# EAGLE design BinaryWatch_v0_4_OptR_fix (EAGLE 9.5.1)
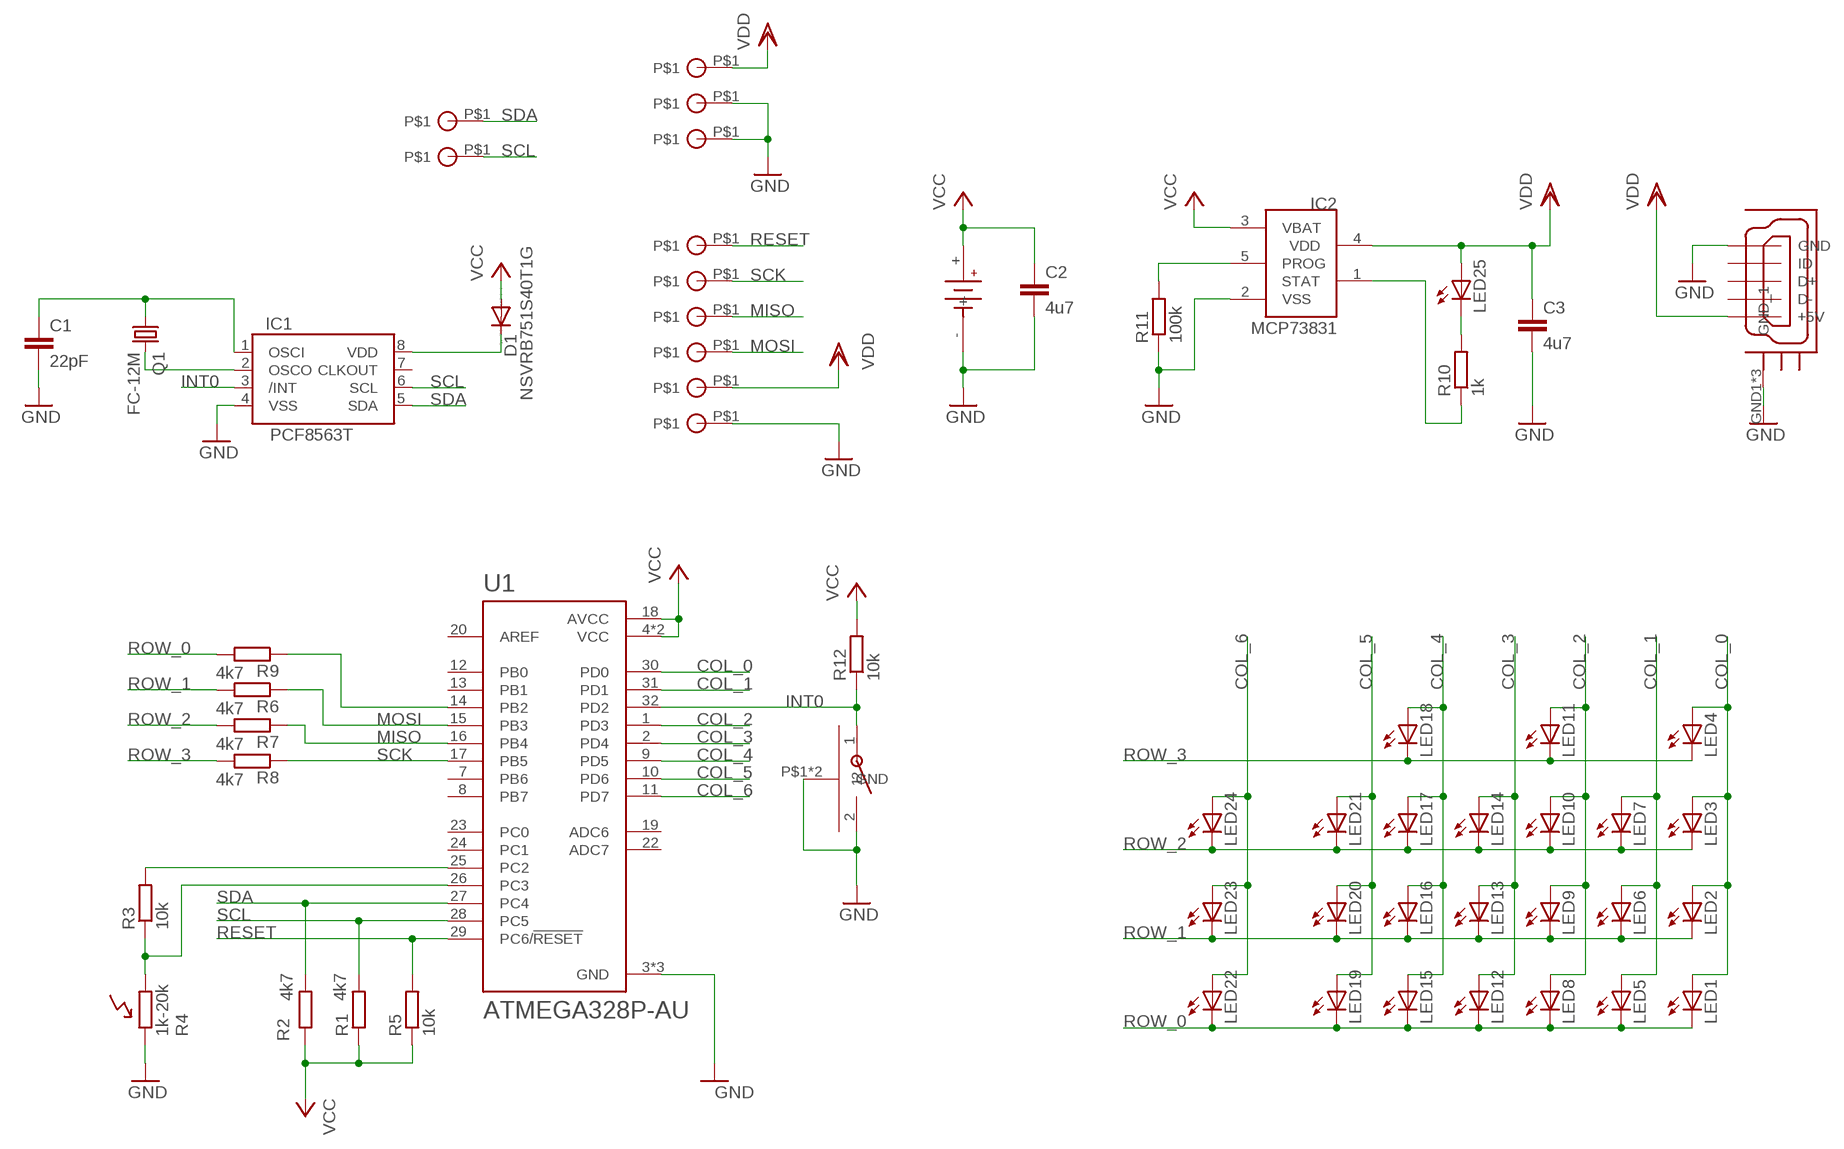
[diagram p0: schematic, sheet 1]

## Parts
C1  22pF  C-EUC0603  [C0603]
C2  4u7  C-EUC0603  [C0603]
C3  4u7  C-EUC0603  [C0603]
D1  NSVRB751S40T1G  DIODE-SOD523  [SOD523]
IC1  PCF8563T  [SO8]
IC2  MCP73831  [SOT23-5L]
LED1  LEDSML0603  [SML0603]
LED2  LEDSML0603  [SML0603]
LED3  LEDSML0603  [SML0603]
LED4  LEDSML0603  [SML0603]
LED5  LEDSML0603  [SML0603]
LED6  LEDSML0603  [SML0603]
LED7  LEDSML0603  [SML0603]
LED8  LEDSML0603  [SML0603]
LED9  LEDSML0603  [SML0603]
LED10  LEDSML0603  [SML0603]
LED11  LEDSML0603  [SML0603]
LED12  LEDSML0603  [SML0603]
LED13  LEDSML0603  [SML0603]
LED14  LEDSML0603  [SML0603]
LED15  LEDSML0603  [SML0603]
LED16  LEDSML0603  [SML0603]
LED17  LEDSML0603  [SML0603]
LED18  LEDSML0603  [SML0603]
LED19  LEDSML0603  [SML0603]
LED20  LEDSML0603  [SML0603]
LED21  LEDSML0603  [SML0603]
LED22  LEDSML0603  [SML0603]
LED23  LEDSML0603  [SML0603]
LED24  LEDSML0603  [SML0603]
LED25  LEDSML0603  [SML0603]
Q1  FC-12M  [FC-12M]
R1  4k7  R-EU_R0603  [R0603]
R2  4k7  R-EU_R0603  [R0603]
R3  10k  R-EU_R0603  [R0603]
R4  1k-20k  OPTO_RES_ROUND_3_5MM  [OPTO_RES_ROUND_3_5MM]
R5  10k  R-EU_R0603  [R0603]
R6  4k7  R-EU_R0603  [R0603]
R7  4k7  R-EU_R0603  [R0603]
R8  4k7  R-EU_R0603  [R0603]
R9  4k7  R-EU_R0603  [R0603]
R10  1k  R-EU_R0603  [R0603]
R11  100k  R-EU_R0603  [R0603]
R12  10k  R-EU_R0603  [R0603]
U1  ATMEGA328P-AU  [QFP80P900X900X120-32N]
U$1  2032  [2032_45DEG]
U$2  CONTACT_1_8MM  [CONTACT_1_8MM]
U$3  CONTACT_1_8MM  [CONTACT_1_8MM]
U$4  CONTACT_1_8MM  [CONTACT_1_8MM]
U$5  CONTACT_1_8MM  [CONTACT_1_8MM]
U$6  CONTACT_1_8MM  [CONTACT_1_8MM]
U$7  CONTACT_1_8MM  [CONTACT_1_8MM]
U$8  TACK_SWITCH  [TL3330]
U$9  CONTACT_1_8MM  [CONTACT_1_8MM]
U$10  MICRO_USB_VERTICAL  [MICRO_USB_VERTICAL]
U$11  CONTACT_1_8MM  [CONTACT_1_8MM]
U$12  CONTACT_1_8MM  [CONTACT_1_8MM]
U$13  CONTACT_1_8MM  [CONTACT_1_8MM]
U$14  CONTACT_1_8MM  [CONTACT_1_8MM]

## Nets
COL_0: LED1.A LED2.A LED3.A LED4.A U1.30(PD0)
COL_1: LED5.A LED6.A LED7.A U1.31(PD1)
COL_2: LED8.A LED9.A LED10.A LED11.A U1.1(PD3)
COL_3: LED12.A LED13.A LED14.A U1.2(PD4)
COL_4: LED15.A LED16.A LED17.A LED18.A U1.9(PD5)
COL_5: LED19.A LED20.A LED21.A U1.10(PD6)
COL_6: LED22.A LED23.A LED24.A U1.11(PD7)
GND: C1.2 C2.2 C3.2 IC1.4(VSS) IC2.2(VSS) R4.P$1 R11.1 U1.3(GND) U1.5(GND) U1.21(GND) U$1.- U$2.P$1 U$8.2 U$8.P$1(GND) U$8.P$2(GND) U$9.P$1 U$10.5(GND) U$10.GND1(GND_1) U$10.GND2(GND_1) U$10.GND3(GND_1) U$12.P$1
INT0: IC1.3(/INT) R12.1 U1.32(PD2) U$8.1
MISO: R7.1 U1.16(PB4) U$5.P$1
MOSI: R6.1 U1.15(PB3) U$4.P$1
N$1: IC1.2(OSCO) Q1.2
N$2: C1.1 IC1.1(OSCI) Q1.1
N$3: R3.1 R4.P$2 U1.26(PC3)
N$4: R3.2 U1.25(PC2)
N$6: R9.1 U1.14(PB2)
N$7: D1.C IC1.8(VDD)
N$12: IC2.1(STAT) R10.1
N$13: LED25.C R10.2
N$15: IC2.5(PROG) R11.2
RESET: R5.2 U1.29(PC6/!RESET) U$7.P$1
ROW_0: LED1.C LED5.C LED8.C LED12.C LED15.C LED19.C LED22.C R9.2
ROW_1: LED2.C LED6.C LED9.C LED13.C LED16.C LED20.C LED23.C R6.2
ROW_2: LED3.C LED7.C LED10.C LED14.C LED17.C LED21.C LED24.C R7.2
ROW_3: LED4.C LED11.C LED18.C R8.2
SCK: R8.1 U1.17(PB5) U$6.P$1
SCL: IC1.6(SCL) R1.2 U1.28(PC5) U$14.P$1
SDA: IC1.5(SDA) R2.2 U1.27(PC4) U$13.P$1
VCC: C2.1 D1.A IC2.3(VBAT) R1.1 R2.1 R5.1 R12.2 U1.4(VCC) U1.6(VCC) U1.18(AVCC) U$1.+
VDD: C3.1 IC2.4(VDD) LED25.A U$3.P$1 U$10.1(+5V) U$11.P$1
Unconnected: IC1.7(CLKOUT) U1.7(PB6) U1.8(PB7) U1.12(PB0) U1.13(PB1) U1.19(ADC6) U1.20(AREF) U1.22(ADC7) U1.23(PC0) U1.24(PC1) U$10.2(D-) U$10.3(D+) U$10.4(ID)

## Library data of the parts
C1-C3 = rcl:C-EU: CAPACITOR, European symbol
D1 = diode:DIODE-: DIODE
IC1 = philips-4:PCF8563
IC2 = microchip-update:MCP73831: Miniature Single-Cell, Fully Integrated Li-Ion, Li-Polymer Charge Management Controllers
LED1-LED25 = led:LED: LED OSRAM: - CHIPLED LG R971, LG N971, LY N971, LG Q971, LY Q971, LO R971, LY R971 LH N974, LH R974 LS Q976, LO Q976, LY Q976 LO Q996 - Hyper CHIPLED LW Q18S LB Q993, LB Q99A, LB R99A - SideLED LS A670, LO A670, LY A670, LG A670, LP A670 LB A673, LV A673, LT A673, LW A673 LH A674 LY A675 LS A676, LA A676, LO A676, LY A676, LW A676 LS A679, LY A679, LG A679 - Hyper Micro SIDELED® LS Y876, LA Y876, LO Y876, LY Y876 LT Y87S - SmartLED LW L88C, LW L88S LB L89C, LB L89S, LG L890 LS L89K, LO L89K, LY L89K LS L896, LA L896, LO L896, LY L896 - TOPLED LS T670, LO T670, LY T670, LG T670, LP T670 LSG T670, LSP T670, LSY T670, LOP T670, LYG T670 LG T671, LOG T671, LSG T671 LB T673, LV T673, LT T673, LW T673 LH T674 LS T676, LA T676, LO T676, LY T676, LB T676, LH T676, LSB T676, LW T676 LB T67C, LV T67C, LT T67C, LS T67K, LO T67K, LY T67K, LW E67C LS E67B, LA E67B, LO E67B, LY E67B, LB E67C, LV E67C, LT E67C LW T67C LS T679, LY T679, LG T679 LS T770, LO T770, LY T770, LG T770, LP T770 LB T773, LV T773, LT T773, LW T773 LH T774 LS E675, LA E675, LY E675, LS T675 LS T776, LA T776, LO T776, LY T776, LB T776 LHGB T686 LT T68C, LB T68C - Hyper Mini TOPLED® LB M676 - Mini TOPLED Santana® LG M470 LS M47K, LO M47K, LY M47K Source: http://www.osram.convergy.de LUXEON: - LUMILED® LXK2-PW12-R00, LXK2-PW12-S00, LXK2-PW14-U00, LXK2-PW14-V00 LXK2-PM12-R00, LXK2-PM12-S00, LXK2-PM14-U00 LXK2-PE12-Q00, LXK2-PE12-R00, LXK2-PE12-S00, LXK2-PE14-T00, LXK2-PE14-U00 LXK2-PB12-K00, LXK2-PB12-L00, LXK2-PB12-M00, LXK2-PB14-N00, LXK2-PB14-P00, LXK2-PB14-Q00 LXK2-PR12-L00, LXK2-PR12-M00, LXK2-PR14-Q00, LXK2-PR14-R00 LXK2-PD12-Q00, LXK2-PD12-R00, LXK2-PD12-S00 LXK2-PH12-R00, LXK2-PH12-S00 LXK2-PL12-P00, LXK2-PL12-Q00, LXK2-PL12-R00 Source: www.luxeon.com KINGBRIGHT: KA-3528ASYC Source: www.kingbright.com
Q1 = crystal:FC-12M: kHz RANGE CRYSTAL UNIT LOW PROFILE SMD Source: Epson Toyocom FC-12M.pdf
R1 R2 R5-R9 = resistor:R-EU_: RESISTOR, European symbol
R3 R10 R11 = rcl:R-EU_: RESISTOR, European symbol
R4 = opto-resistor:OPTO_RES_ROUND_3_5MM
R12 = rcl:R-EU_: RESISTOR, European symbol; SPICEPREFIX: R
U1 = ATMEGA328P-AU:ATMEGA328P-AU: ATmega Series 20 MHz 32 KB Flash 2 KB SRAM 8-Bit Microcontroller - TQFP-32; AVAILABILITY: Unavailable; DESCRIPTION: Microcontroller Mcu, 8 Bit, Atmega, 20mhz, Tqfp-32; MF: Microchip; MP: ATMEGA328P-AU; PACKAGE: TQFP-32 Microchip; PRICE: None
U$1 = 2032 free standing:2032
U$2-U$7 U$9 U$11-U$14 = Pins, switches:CONTACT_1_8MM
U$8 = Pins, switches:TACK_SWITCH
U$10 = Pins, switches:MICRO_USB_VERTICAL

## Board
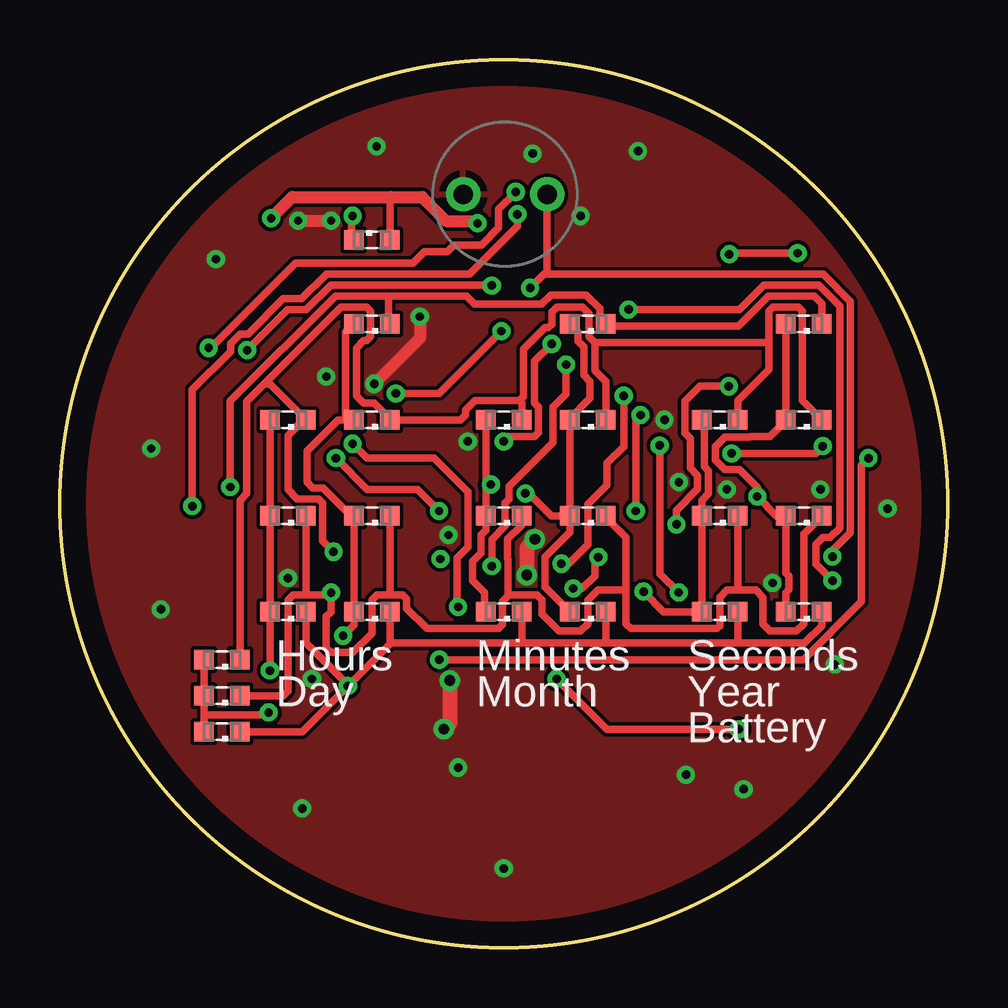
[diagram p1: board, top side]
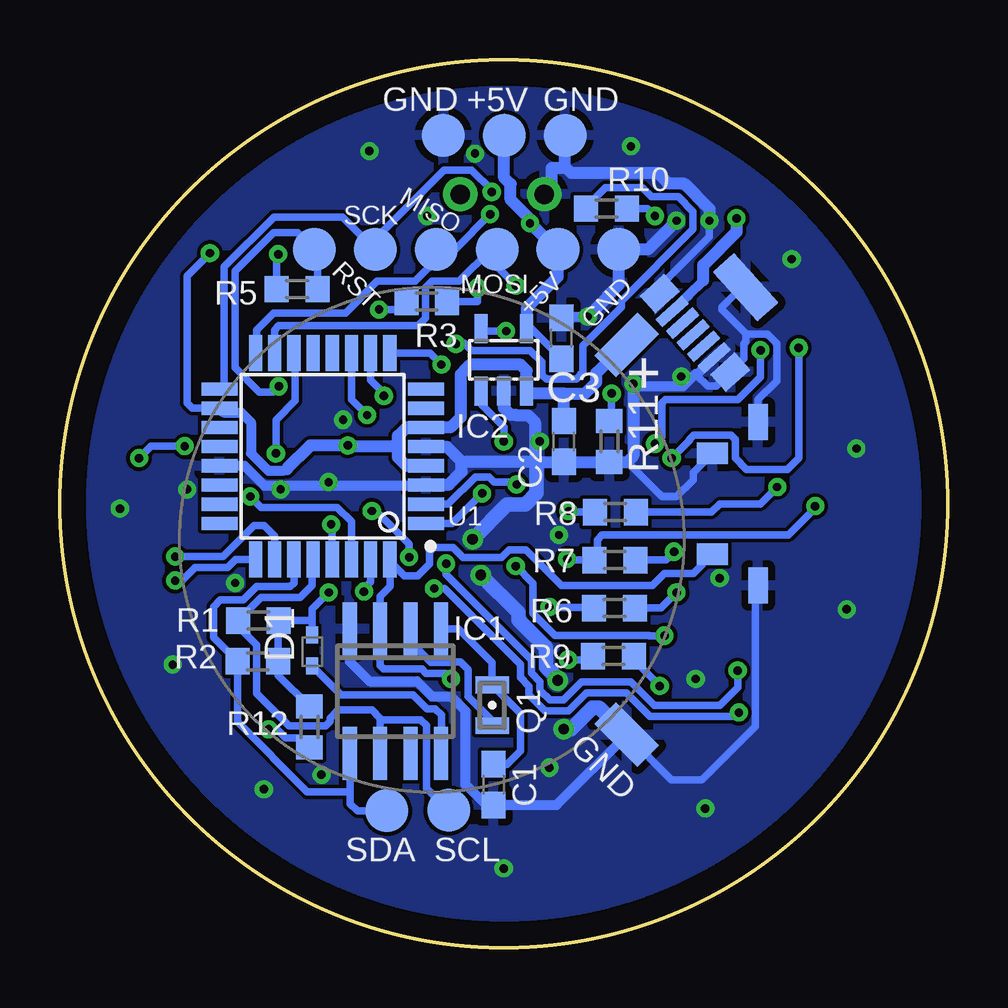
[diagram p2: board, bottom side, seen from below]

Size 37 x 37 mm. Coordinates in mm from the lower left corner, seen from the top.
Outline: circle at 18.5,18.5 radius 18.5
Copper layers (1*16): Top 0.035mm / dielectric 1.5mm / Bottom 0.035mm
Design rules "default *": minimum track width 6mil, minimum drill 0.35mm, track to track 6mil, track to pad 6mil, pad to pad 6mil, via to via 6mil, smd to smd 6mil, copper to edge 40mil, drill to drill 6mil, minimum pad ring 10mil, minimum via ring 8mil, stop-mask expansion 2mil, vias tented up to drill 0.46mm, thermal gap 12mil

### Footprints (pad centres in the part's own frame; a part is rotated, then mirrored left to right if it is on the bottom)
C0603 = smd 1.1 x 1: 1 -0.85,0; 2 0.85,0
SOD523 = smd 0.7 x 0.5: A 0.7,0; C -0.6,0
SO8 = smd 0.6 x 2.2: 1 -1.905,-2.6; 2 -0.635,-2.6; 3 0.635,-2.6; 4 1.905,-2.6; 5 1.905,2.6; 6 0.635,2.6; 7 -0.635,2.6; 8 -1.905,2.6
SOT23-5L = smd 0.55 x 1.2: 1 -0.95,-1.3; 2 0,-1.3; 3 0.95,-1.3; 4 0.95,1.3; 5 -0.95,1.3
SML0603 = smd 0.8 x 0.8: A 0.75,0; C -0.75,0
FC-12M = smd 0.7 x 1.4: 1 -0.85,0; 2 0.85,0
R0603 = smd 1 x 1.1: 1 -0.85,0; 2 0.85,0
OPTO_RES_ROUND_3_5MM = drill 0.8 pad 1.422: P$1 -1.75,0; P$2 1.75,0
QFP80P900X900X120-32N = smd 1.5 x 0.55: 1 -4.3,2.8; 2 -4.3,2; 3 -4.3,1.2; 4 -4.3,0.4; 5 -4.3,-0.4; 6 -4.3,-1.2; 7 -4.3,-2; 8 -4.3,-2.8; 17 4.3,-2.8; 18 4.3,-2; 19 4.3,-1.2; 20 4.3,-0.4; 21 4.3,0.4; 22 4.3,1.2; 23 4.3,2; 24 4.3,2.8 | smd 0.55 x 1.5: 9 -2.8,-4.3; 10 -2,-4.3; 11 -1.2,-4.3; 12 -0.4,-4.3; 13 0.4,-4.3; 14 1.2,-4.3; 15 2,-4.3; 16 2.8,-4.3; 25 2.8,4.3; 26 2,4.3; 27 1.2,4.3; 28 0.4,4.3; 29 -0.4,4.3; 30 -1.2,4.3; 31 -2,4.3; 32 -2.8,4.3
2032_45DEG = smd 1.27 x 2.54: + 0,11.5 | smd 2.54 x 1.27: - 11.5,0
CONTACT_1_8MM = smd 1.8 x 1.8: P$1 0,0
TL3330 = smd 0.9 x 1.3: 1 0.55,2.3; 2 4.75,2.3 | smd 1.5 x 0.8: P$1 -0.75,0.4; P$2 6.05,0.4
MICRO_USB_VERTICAL = smd 0.45 x 1.5: 1 0.25,0.75; 2 0.9,0.75; 3 1.55,0.75; 4 2.2,0.75; 5 2.85,0.75 | smd 1 x 1.4: GND1 -0.65,0.85; GND3 3.75,0.85 | smd 2.8 x 1.2: GND2 1.55,3.7

### Placement (x,y rotation side)
C1  18.93,6.79 270 bottom
C2  16,21.1 270 bottom
C3  16.1,25.4 90 bottom
D1  26.48,12.34 90 bottom
IC1  23.02,10.69 180 bottom
IC2  18.5,24.5 0 bottom
LED1  31,14 180 top
LED2  31,18 180 top
LED3  31,22 180 top
LED4  31,26 180 top
LED5  27.5,14 180 top
LED6  27.5,18 180 top
LED7  27.5,22 180 top
LED8  22,14 180 top
LED9  22,18 180 top
LED10  22,22 180 top
LED11  22,26 180 top
LED12  18.5,14 180 top
LED13  18.5,18 180 top
LED14  18.5,22 180 top
LED15  13,14 180 top
LED16  13,18 180 top
LED17  13,22 180 top
LED18  13,26 180 top
LED19  9.5,14 180 top
LED20  9.5,18 180 top
LED21  9.5,22 180 top
LED22  6.75,9 180 top
LED23  6.75,10.5 180 top
LED24  6.75,12 180 top
LED25  13,29.5 0 top
Q1  18.98,10.1 270 bottom
R1  28.73,13.63 180 bottom
R2  28.75,11.93 180 bottom
R3  21.71,26.92 180 bottom
R4  18.56,31.4 0 top
R5  27.11,27.45 0 bottom
R6  13.89,14.15 0 bottom
R7  13.87,16.15 0 bottom
R8  13.85,18.15 0 bottom
R9  13.93,12.15 0 bottom
R10  14.22,30.8 0 bottom
R11  14.1,21.1 90 bottom
R12  26.6,9.2 90 bottom
U1  26.05,20.48 180 bottom
U$1  21.5,17 315 bottom
U$2  13.7,29.1 270 bottom
U$3  16.24,29.1 270 bottom
U$4  18.78,29.1 270 bottom
U$5  21.32,29.1 270 bottom
U$6  23.86,29.1 270 bottom
U$7  26.4,29.1 270 bottom
U$8  7.5,15.85 90 bottom
U$9  21.02,33.86 0 bottom
U$10  12.2,26.2 312 bottom
U$11  18.48,33.86 0 bottom
U$12  15.94,33.86 0 bottom
U$13  23.37,5.7 0 bottom
U$14  20.8,5.72 0 bottom

### Tracks (layer width: path | path; a pad name or v marks a point on that pad's centre or on a via)
COL_0  (via drill 0.35)
  Top 0.305: LED4.A LED3.A 30.25,21.95 29.6,21.3 28.78,21.3 28.76,21.28 27.72,21.28 27.32,20.88 27.32,20.32 27.72,19.92 28.33,19.92 29.07,19.18 v29.07,18.8 29.87,18 LED2.A 30.25,15.62 30.38,15.48 30.38,14.92 30.25,14.78 LED1.A
  Bottom 0.305: U1.30 24.85,17.76 25.44,18.35 28.62,18.35 v29.07,18.8
COL_1  (via drill 0.35)
  Top 0.2: 26.75,21.95 26.8,22
  Top 0.305: 26.8,22 26.86,21.94 26.86,20.05 27.04,19.87 27.04,18.93 26.75,18.64 LED6.A LED5.A 25.17,14 v24.32,14.84 | LED7.A 26.75,21.95
  Bottom 0.305: U1.31 24.05,15.25 24.32,14.98 v24.32,14.84
COL_2  (via drill 0.35)
  Top 0.305: LED9.A LED10.A 21.25,22.05 22.1,22.9 22.1,23.6 21.84,23.86 21.84,25.04 21.59,25.28 21.59,25.66 LED11.A | LED9.A 21.25,17.32 20.22,16.28 20.22,15.03 LED8.A | LED9.A 20.48,18 19.55,18.93 v19.4,18.93
  Bottom 0.305: U1.1 20.65,17.68 v19.4,18.93
COL_3  (via drill 0.35)
  Top 0.152: 17.7,14 LED12.A
  Top 0.305: 17.7,14 17.7,14.8 17.2,15.3 17.2,16.1 17.54,16.44 17.54,17.21 17.75,17.42 LED13.A 17.75,19.09 v17.96,19.3 17.75,19.51 LED14.A
  Bottom 0.305: U1.2 20.82,18.48 19.68,19.61 19.12,19.61 18.9,19.4 18.06,19.4 v17.96,19.3
COL_4  (via drill 0.35)
  Top 0.2: LED15.A 12.25,14.2
  Top 0.305: 12.25,14.2 12.25,13.45 v11.8,13 | LED15.A LED16.A 12.13,18 10.97,19.16 10.54,19.16 10.3,19.4 10.3,20.7 11.6,22 11.9,22 | 11.9,22 LED17.A | v21.1,24.3 21.1,23.08 20.55,22.53 20.55,21.04 18.72,19.21 18.72,18.7 18.55,18.53 18.55,17.56 18,17.02 v18,15.9 | LED18.A 11.91,25.66 11.91,23.52 11.9,23.51 11.9,22
  Bottom 0.305: U1.9 21.58,24.78 v21.1,24.3 | v11.8,13 12.45,13 12.45,13.01 16.37,13.01 17.28,13.92 17.28,15.18 v18,15.9
COL_5  (via drill 0.35)
  Top 0.305: v20.9,16 21.2,16 22,16.8 22,18.48 22.81,19.29 22.81,20.19 23.5,20.89 v23.5,23 | LED21.A LED20.A LED19.A v8.75,11.55
  Bottom 0.305: v20.9,16 20.9,15.55 17.34,12 17.34,11.44 16.98,11.08 16.98,10.72 16.58,10.32 16.02,10.32 15.26,11.08 13.2,11.08 12.22,10.1 9.5,10.1 8.75,10.85 v8.75,11.55 | U1.10 24.05,23.65 23.5,23.1 v23.5,23
COL_6  (via drill 0.35)
  Top 0.305: v22.44,16.28 22.3,16.13 22.3,15.5 21.77,14.97 v21.4,14.97 | LED24.A LED23.A 6,9.8 | v24,18.2 24,22 v24.2,22.2 | LED22.A 6,9.8 | v8.7,9.8 8.61,9.71 6.09,9.71 6,9.8
  Bottom 0.305: v21.4,14.97 20.96,14.97 17.8,11.81 17.8,11.25 17.44,10.89 17.44,10.53 16.77,9.86 15.8,9.86 15.04,10.62 13.39,10.62 12.41,9.64 8.86,9.64 v8.7,9.8 | v22.44,16.28 22.44,16.83 23.81,18.2 v24,18.2 | v24.2,22.2 24.85,22.85 U1.11
GND  (via drill 0.35, 0.45)
  Top 0.508: v9.93,30.3 v11.3,30.3 | v15,26.3 15,25.4 v13.1,23.5
  Top 0.61: v16,9.1 16.25,9.35 v16.25,11.13 | v19.46,15.53 19.46,16.68 v19.8,17.02
  Bottom 0.305: 13.35,20.25 11.9,18.8 11.3,18.8 10.6,19.5 10.6,19.8 U$8.2 | 18.5,22.75 IC2.2 | 10.51,23.91 10.46,23.86 10,23.4 9.64,23.4 U$10.GND3 8.48,24.56 8.48,25.18 8.41,25.25 8.41,25.6 | U$10.GND1 12,27.55 9.93,29.63 v9.93,30.3 | U$8.P$2 7.9,22.83 7.12,23.62 7.12,25.18 7.52,25.58 8.4,25.58 8.41,25.6 | 13.12,9.12 U$1.- 11.5,7 10.23,7 8.02,9.22 8.02,14.98 U$8.P$1 | U$10.GND2 8.58,27.52 9.4,26.7 9.4,26.59 8.41,25.6
  Bottom 0.406: 10.51,23.91 11.01,23.41 13.01,23.41 v13.1,23.5 | 10.46,23.86 U$10.5 | C3.2 16.05,26.3 v15,26.3 | 21.02,33.88 U$9.P$1 | U1.3 21.78,19.31 21.83,19.26 28.48,19.26 29.31,20.08 U1.21 | IC1.4 24.93,11.93 24.1,11.1 22.12,11.1 21.49,10.47 20.7,10.47 20.1,9.87 20.1,6.8 19.24,5.94 C1.2 16.3,5.94 U$1.-
  Bottom 0.508: 18.5,22.75 18.5,22.5 18.2,22.2 18,22.2 17.99,22.19 17.49,22.19 17.21,21.91 17.21,20.25 | 17.21,20.25 C2.2 R11.1 13.35,20.25 13.1,20.5 v13.1,23.5 | 17.21,20.25 18.86,20.25 18.87,20.26 20.26,20.26 | U1.5 20.88,20.88 20.26,20.26 | U1.3 21.02,19.28 21,19.3 20.8,19.3 20.26,19.84 20.26,20.26 | v9.93,30.3 9.93,30.79 10.99,31.86 11.66,31.86 12.08,32.28 15.68,32.28 15.94,32.54 | v11.3,30.3 11.41,30.18 12.49,29.1 U$2.P$1 13.7,27.64 14.16,27.18 14.16,27.14 v15,26.3 | 15.94,32.54 15.94,32.5 16.5,32.5 16.5,31.46 R4.P$1 | 15.94,32.54 U$12.P$1
  Bottom 0.61: 13.6,9.1 U$1.- 14.5,10 14.8,10 15.7,9.1 v16,9.1 | v19.46,15.53 17.89,13.96 17.89,13.66 16.73,12.51 16.73,11.7 16.25,11.21 v16.25,11.13 | v19.8,17.02 18.36,18.46 17.6,18.46 17.13,18.94 17.13,20.17 17.21,20.25
  other vias: 3.8,20.8 4.2,14.1 10.1,5.8 18.5,3.3 28.5,6.6 32.3,11.8 34.5,18.3 24.1,33.2 13.2,33.4 6.5,28.7 11.1,23.8 16.2,17.2 25.8,19.4 25.2,22 21.7,30.5 19.7,33.1 31.7,19.1 27.8,19.1 26.1,7.2 29.7,15.2 17,21.1 10.5,11.2 16.6,7.5 9.5,15.4
  pour Bottom: -4.3,32.1 -4.3,5.6 3,-1.7 3.4,-2.1 34.2,-2.1 39.7,3.4 39.7,21.7 39.7,37.1 37,39.8 35,41.8 0.4,41.8 -4.3,37.1
  pour Top: -0.7,28.1 -0.7,-0.6 -0.2,-1.1 0.6,-1.9 37.3,-1.9 42.7,3.5 42.7,16.3 42.7,35.5 41.3,36.9 37.4,40.8 12.6,40.8 8.1,40.8 1.2,33.9 -0.8,31.9 -0.8,27.9
INT0  (via drill 0.35)
  Top 0.305: v28.3,9.1 22.8,9.1 v20.7,11.2
  Bottom 0.305: U$8.1 10.6,15.6 11.8,15.6 12.3,15.1 16.1,15.1 17.58,16.58 18.28,16.58 18.6,16.27 20.2,16.27 20.62,16.68 21.42,16.68 21.6,16.5 21.6,16 22.1,15.5 22.63,15.5 23.13,16 23.13,16.06 U1.32 23.25,15.05 23.66,14.64 IC1.3 23.66,11.76 23.51,11.61 21.91,11.61 21.73,11.43 20.93,11.43 v20.7,11.2 | R12.1 26.99,8.74 27.59,8.74 27.95,9.1 v28.3,9.1
MISO  (via drill 0.35)
  Top 0.305: v5.52,18.4 5.52,23.25 7.12,24.85 7.12,25.18 7.52,25.58 7.84,25.58 9.3,27.05 10.08,27.05 11.11,28.08 17.08,28.08 19.07,30.07 v19.07,30.57
  Bottom 0.152: 14.71,16.17 R7.1 | 28.8,24.83 U1.16
  Bottom 0.305: v15.86,16.2 15.82,16.17 14.71,16.17 | 28.8,24.83 28.8,25.75 28.09,26.46 25.1,26.46 23.78,27.77 22.21,27.77 21.32,28.66 U$5.P$1 20.53,29.1 v19.07,30.57 | R7.1 14.6,16.27 14.6,17 14.4,17.2 6.63,17.2 5.52,18.32 v5.52,18.4
MOSI  (via drill 0.35)
  Top 0.305: v12.2,21 12.8,20.4 15.6,20.4 17,19 17,16.69 16.55,16.25 16.55,14.25 v16.6,14.2 | v7.8,24.9 9.49,26.59 10.27,26.59 11.3,27.62 17.98,27.62 v18,27.6
  Bottom 0.305: v16.6,14.2 16.57,14.17 14.76,14.17 R6.1 | v12.2,21 11.9,21.3 11.9,22.7 11.76,22.84 8.74,22.84 7.8,23.78 v7.8,24.9 | U1.15 28.05,25.75 27.88,25.92 22.08,25.92 21.75,26.24 21.75,27.51 21.48,27.77 20.36,27.77 19.03,29.1 U$4.P$1 18.78,28.38 v18,27.6
N$1
  Bottom 0.2: 22.39,12.65 IC1.2
  Bottom 0.305: Q1.2 18.98,9.47 19.98,10.47 19.98,11.59 20.3,11.9 20.67,11.9 20.69,11.88 21.54,11.88 22.31,12.65 22.39,12.65
N$2
  Bottom 0.305: C1.1 18.36,7.64 17.8,8.2 17.8,9.77 Q1.1 18.98,11.88 20.39,13.29 IC1.1
N$3  (via drill 0.35)
  Top 0.305: v32.2,16.3 32.2,16.55 32.96,17.31 32.96,26.94 31.82,28.08 20.31,28.08 | v19.6,27.5 20.18,28.08 20.31,28.08 | R4.P$2 20.31,28.08
  Bottom 0.305: U1.26 28.05,17.15 28.5,17.6 28.9,17.6 30.2,16.3 v32.2,16.3 | R3.1 19.6,26.92 v19.6,27.5
N$4  (via drill 0.35)
  Top 0.305: v23.7,26.6 28.33,26.6 29.34,27.62 31.63,27.62 32.5,26.75 32.5,17.5 32.1,17.1 31.8,17.1 31.5,16.8 31.5,16 v32.2,15.3
  Bottom 0.305: R3.2 22.88,26.6 v23.7,26.6 | v32.2,15.3 31.9,15.3 31.36,15.84 30.01,15.84 29.67,16.18 U1.25
N$6  (via drill 0.35)
  Top 0.305: v28,20.6 31.5,20.6 v31.8,20.9 | v33.7,20.4 33.41,20.11 33.41,14.43 30.98,12 v15.81,12
  Bottom 0.305: v31.8,20.9 33.2,20.9 v33.7,20.4 | v15.81,12 14.93,12 R9.1 | 27.2,24.73 27.2,22.8 28,22 v28,20.6
  Bottom 0.406: 27.2,24.73 U1.14
N$7
  Bottom 0.305: D1.C 25.28,10.54 22.27,10.54 21.7,9.96 21.36,9.96 21.1,9.7 21.1,9.01 21.11,9 IC1.8
N$12  (via drill 0.35)
  Top 0.305: v20.5,25.17 19.78,24.45 19.78,22.7 19.95,22.53 19.95,21.47 19.78,21.3 18.7,21.3 v18.5,21.1
  Bottom 0.305: R10.1 15.07,30.87 14.26,31.68 12.73,31.68 12.35,31.3 11.22,31.3 10.61,30.68 10.61,29.94 13.6,26.95 13.6,26.7 15.2,25.1 15.2,24 15.29,23.91 15.29,23.87 15.47,23.7 16.73,23.7 16.91,23.87 16.91,24.4 17.4,24.89 19.85,24.89 20.16,25.2 20.43,25.2 20.47,25.17 v20.5,25.17 | v18.5,21.1 18.5,21.7 19.45,22.65 IC2.1
N$13  (via drill 0.35)
  Top 0.305: LED25.C 12.15,29.6 12.15,30.45 v12.2,30.5
  Bottom 0.305: v12.2,30.5 12.5,30.8 R10.2
N$15  (via drill 0.35)
  Top 0.305: v18.4,25.7 15.8,23.1 v14,23.1
  Bottom 0.305: v14,23.1 14,22.05 R11.2 | IC2.5 19.35,25.7 v18.4,25.7
RESET  (via drill 0.35)
  Top 0.305: v27.88,23.4 26.67,23.4 26.05,22.78 26.05,21.45 26.28,21.21 26.28,19.98 26.58,19.68 26.58,19.12 25.69,18.22 v25.69,17.65 v25.7,17.64
  Bottom 0.305: R5.2 26.26,28.96 U$7.P$1 27.1,29.8 28.09,29.8 29.7,28.19 29.7,24.17 28.69,23.17 28.12,23.17 v27.88,23.4 | v25.7,17.64 25.65,17.59 U1.29
ROW_0  (via drill 0.35)
  Top 0.2: 28.3,12.7 28.25,12.75
  Top 0.305: 19.2,12.7 13.8,12.7 | 19.2,12.7 22.7,12.7 | 22.7,12.7 28.3,12.7 31.03,12.7 31.75,13.42 LED1.C | LED8.C 22.75,12.75 22.7,12.7 | LED12.C 19.25,12.75 19.2,12.7 | LED15.C 13.75,12.75 13.8,12.7 | 13.8,12.7 v12,10.9 | 28.25,12.75 LED5.C | LED22.C 10.1,9 v12,10.9 | v12,10.9 12,10.95 10.25,12.7 LED19.C
  Bottom 0.305: R9.2 13.08,11.98 v12,10.9
ROW_1  (via drill 0.35)
  Top 0.152: 22.7,18 LED9.C
  Top 0.305: 22.7,18 23.6,17.1 23.6,14.9 | 23.6,14.9 23.6,13.5 23.8,13.29 27.39,13.29 27.5,13.4 27.5,14.6 27.8,14.9 28.2,14.9 | 23.6,14.9 22.42,14.9 22,14.48 22,13.5 21.7,13.2 20.8,13.2 20.1,13.9 20.1,14.5 19.89,14.7 18.72,14.7 | LED2.C 31,17.25 31,13.5 30.7,13.2 29.6,13.2 29.3,13.5 29.3,14.6 29,14.9 28.2,14.9 | 13.8,14.7 14.28,14.7 14.46,14.53 14.46,14.14 15.3,13.29 18.28,13.29 18.45,13.47 18.45,14.44 18.72,14.7 | 13.8,14.7 13.22,14.7 13,14.48 13,13.1 12.2,12.3 11.3,12.3 11.1,12.5 11.1,13.79 11.3,13.99 v11.3,14.8 11.21,14.7 10.3,14.7 | 13.8,14.7 13.75,14.75 LED16.C | LED13.C 19.25,17.62 18.66,17.04 18.66,16.2 18.68,16.18 18.68,14.75 18.72,14.7 | LED6.C 28.25,14.95 28.2,14.9 | LED23.C 9.3,10.5 9.5,10.7 9.5,14.48 9.72,14.7 10.3,14.7 | 10.3,14.7 10.25,14.75 LED20.C
  Bottom 0.305: R6.2 11.95,14.15 v11.3,14.8
ROW_2  (via drill 0.35)
  Top 0.305: LED3.C 30.95,22.8 30.95,26.53 30.78,26.7 29.72,26.7 29.55,26.53 29.55,25.3 | 29.55,25.3 29.55,24.09 28.25,22.8 LED7.C | LED10.C 22.75,23.6 22.29,24.06 22.29,25.23 | LED14.C 19.25,22.7 19.15,22.8 | 19.15,22.8 17.3,22.8 16.9,22.4 16.9,22.2 16.7,22 13.8,22 | 13.8,22 LED17.C | 13.8,22 13.1,22.7 12.78,22.7 12.65,22.7 12.36,23 12.36,23.32 12.37,23.33 12.37,25 12.66,25.3 12.78,25.3 12.96,25.47 12.96,26.53 12.78,26.7 11.72,26.7 8.51,23.49 | 8.51,23.49 8.76,23.49 LED21.C 10.2,22.05 9.5,21.35 9.5,19.1 9.89,18.7 10.78,18.7 10.96,18.53 10.96,16.95 v11.4,16.5 | 22.29,25.23 22.05,25.47 22.05,26.44 21.78,26.7 20.72,26.7 20.5,26.48 20.5,26 20.35,25.85 20.22,25.85 19.32,24.95 19.32,22.97 19.15,22.8 | 29.55,25.3 29.47,25.23 22.29,25.23 | LED24.C 7.5,18.63 7.78,18.92 7.78,22.76 8.51,23.49
  Bottom 0.305: R7.2 11.75,16.15 v11.4,16.5
ROW_3  (via drill 0.35)
  Top 0.305: LED4.C 31.75,26.85 31.44,27.16 29.53,27.16 28.27,25.9 22.85,25.9 LED11.C 22.5,26.25 22.5,26.62 21.93,27.2 20.47,27.2 20.08,26.82 17.28,26.82 16.94,27.16 13.7,27.16 | 13.7,27.16 11.49,27.16 7.1,22.77 v7.1,19.2 | LED18.C 13.7,26.05 13.7,27.16
  Bottom 0.305: R8.2 9.85,18.15 9.5,18.5 7.8,18.5 v7.1,19.2
SCK  (via drill 0.35)
  Top 0.305: v11.5,20.4 12.8,19.1 14.9,19.1 v15.8,18.2 | v6.2,25 6.29,25 9.82,28.53 14.71,28.53 15.19,29.01 16.15,29.01 16.42,29.28 17.57,29.28 18.29,30.01 18.29,30.79 v19,31.5
  Bottom 0.305: R8.1 15.75,18.15 v15.8,18.2 | U1.17 30.16,23.47 30.16,28.38 28.08,30.46 25.22,30.46 U$6.P$1 23.86,29.54 20.98,32.42 19.84,32.42 19,31.58 v19,31.5 | v11.5,20.4 10.76,21.14 10.76,21.18 10.58,21.36 9.02,21.36 8.84,21.18 8.84,20.4 8.38,19.93 6.67,19.93 6.2,20.4 v6.2,25
SCL
  Bottom 0.2: 26.5,16.13 U1.28
  Bottom 0.305: 26.5,16.13 26.5,15.1 27,14.6 28.61,14.6 R1.2 29.5,13.71 29.5,13.32 28.8,12.61 28.8,11.25 28.8,10.6 27.45,9.24 25.92,9.24 25.75,9.42 25.75,9.55 25.4,9.9 24,9.9 23.66,9.55 | IC1.6 23.66,9.55 | 23.66,9.55 23.59,9.49 21.96,9.49 21.72,9.26 21.72,6.64 U$14.P$1
SDA
  Bottom 0.305: U1.27 27.25,15.21 27.4,15.06 28.8,15.06 29.37,14.48 30.32,14.48 30.6,14.2 30.6,12.93 R2.2 29.6,9.4 26.7,6.5 24.9,6.5 | U$13.P$1 24.6,5.7 24.9,6 24.9,6.5 | IC1.5 24.9,8.06 24.9,6.5
VCC  (via drill 0.35)
  Top 0.305: v30.75,28.95 27.95,28.95 v27.9,28.9 | v25,20.93 25.02,20.91 25.02,15.58 v25.8,14.8
  Bottom 0.305: 26.48,13.7 D1.A | 26.48,13.7 26.55,13.63 R1.1 27.9,13.61 R2.1 27.9,11.35 R12.2 | 13.55,24.75 13.37,24.93 U$1.+ | U1.18 30.37,22.5 31.5,22.5 31.7,22.7 31.7,28 v30.75,28.95 | v27.9,28.9 27.96,28.84 R5.1 | 17.45,23.1 IC2.3 | v25.8,14.8 26.48,14.12 26.48,13.7
  Bottom 0.406: 13.84,24.75 13.55,24.75 | U1.18 30.18,22.31 29.45,22.31 29.03,21.89 29.03,20.6 28.3,19.87 27.7,19.87 27.67,19.89 27.6,19.89 27.55,19.94
  Bottom 0.508: 16.01,23.1 15.11,23.1 14.64,23.57 14.64,23.95 13.84,24.75 | 16.01,23.1 17.45,23.1 | C2.1 16,23.09 16.01,23.1 | IC2.3 17.55,24.05 17.8,24.3 19.9,24.3 20.11,24.09 20.11,24.07 20.3,23.89 20.3,22.1 20.72,21.68 U1.6 22.55,21.68 22.91,21.32 22.91,20.9 | U1.4 22.55,20.08 22.91,20.44 22.91,20.9 | 22.91,20.9 24.97,20.9 v25,20.93 26.56,20.93 27.55,19.94
VDD  (via drill 0.35)
  Top 0.305: LED25.A 13.75,31.23 13.8,31.28
  Top 0.508: v8.8,30.4 9.14,30.74 9.68,31.28 13.8,31.28 15.1,31.28 16.1,30.28 17.32,30.28 v17.41,30.19
  Bottom 0.305: IC2.4 17.35,25.8 C3.1
  Bottom 0.406: 10.19,27.81 10.19,27.8 10.82,27.17 10.82,27.16 10.88,27.12 U$10.1
  Bottom 0.508: 10.19,27.81 10.19,28.46 8.8,29.84 v8.8,30.4 | IC2.4 17.55,26.65 16.24,27.96 U$3.P$1 16.32,29.1 v17.41,30.19 17.41,30.37 18.21,31.17 18.21,31.83 18.48,32.09 U$11.P$1

### Text on the board
tNames: Hours | Minutes | Seconds | Day | Month | Year | Battery
bNames: GND | +5V | GND | MISO | SCK | RST | MOSI | +5V | GND | + | GND | SCL | SDA